# Altium schematic sheet AQCA-Control-IO-B0.SchDoc
size A4
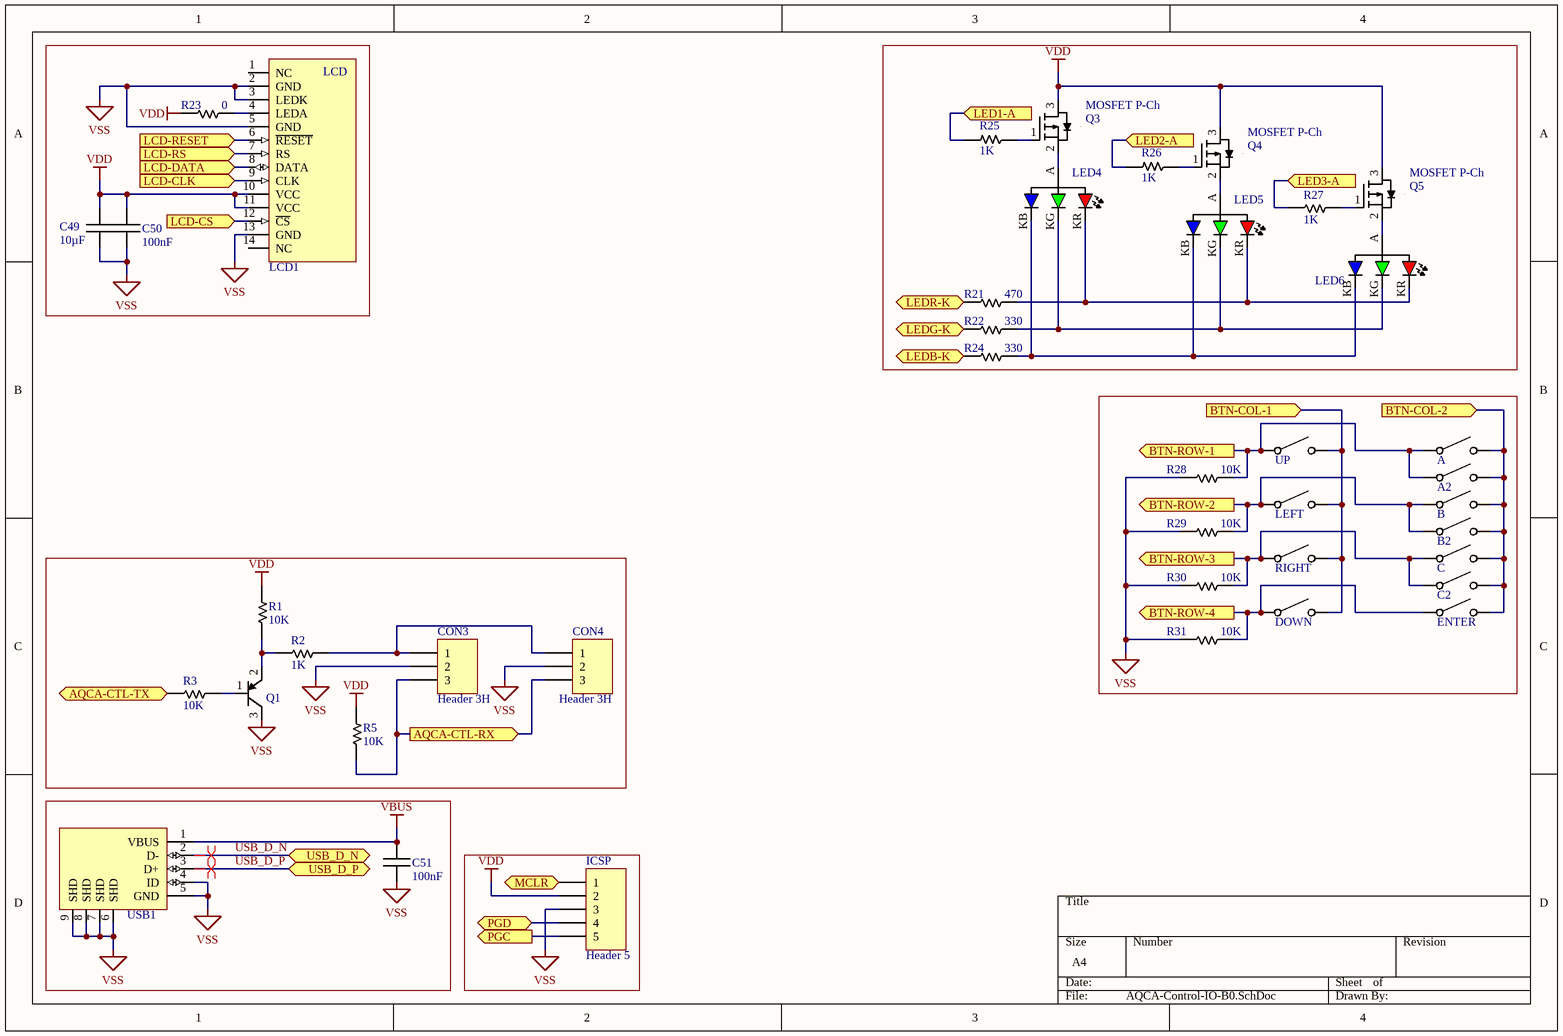
[diagram p0: AQCA-Control-IO-B0.SchDoc]

## Parts
A  Tact Button NO  [TACT SMD 4.5×4.5mm]  (value not drawn)
A2  Tact Button NO  [TACT SMD 4.5×4.5mm]  (value not drawn)
B  Tact Button NO  [TACT SMD 4.5×4.5mm]  (value not drawn)
B2  Tact Button NO  [TACT SMD 4.5×4.5mm]  (value not drawn)
C  Tact Button NO  [TACT SMD 4.5×4.5mm]  (value not drawn)
C2  Tact Button NO  [TACT SMD 4.5×4.5mm]  (value not drawn)
C49  10µF  [CAPC3225N]
C50  100nF  [CAPC1608N]
C51  100nF  [CAPC1608N]
CON3  Header 3H  [HDR1X3H]
CON4  Header 3H  [HDR1X3H]
DOWN  Tact Button NO  [TACT SMD 4.5×4.5mm]  (value not drawn)
ENTER  Tact Button NO  [TACT SMD 4.5×4.5mm]  (value not drawn)
ICSP  Header 5  [HDR1X5]
LCD1  LCD JD-T1800  [LCD JD-T1800]  (value not drawn)
LED4  LED RGB common A  [LED 3528m]  (value not drawn)
LED5  LED RGB common A  [LED 3528m]  (value not drawn)
LED6  LED RGB common A  [LED 3528m]  (value not drawn)
LEFT  Tact Button NO  [TACT SMD 4.5×4.5mm]  (value not drawn)
Q1  *  [SOT23_N]  (value not drawn)
Q3  MOSFET P-Ch  [SOT23-3N]
Q4  MOSFET P-Ch  [SOT23-3N]
Q5  MOSFET P-Ch  [SOT23-3N]
R1  10K  [RESC1608N]
R2  1K  [RESC1608N]
R3  10K  [RESC1608N]
R5  10K  [RESC1608N]
R21  470  [RESC1608N]
R22  330  [RESC1608N]
R23  0  [RESC1608N]
R24  330  [RESC1608N]
R25  1K  [RESC1608N]
R26  1K  [RESC1608N]
R27  1K  [RESC1608N]
R28  10K  [RESC1608N]
R29  10K  [RESC1608N]
R30  10K  [RESC1608N]
R31  10K  [RESC1608N]
RIGHT  Tact Button NO  [TACT SMD 4.5×4.5mm]  (value not drawn)
UP  Tact Button NO  [TACT SMD 4.5×4.5mm]  (value not drawn)
USB1  USB-Conn Mini-B SMD  [440478]  (value not drawn)

## Ports
AQCA-CTL-RX (out), AQCA-CTL-TX (in), BTN-COL-1 (in), BTN-COL-2 (in), BTN-ROW-1 (out), BTN-ROW-2 (out), BTN-ROW-3 (out), BTN-ROW-4 (out), LCD-CLK (in), LCD-CS (in), LCD-DATA (in), LCD-RESET (in), LCD-RS (in), LED1-A (in), LED2-A (in), LED3-A (in), LEDB-K (in), LEDG-K (in), LEDR-K (in), MCLR (out), PGC (out), PGD (bidir), USB_D_N (bidir), USB_D_P (bidir)

## Nets
VBUS: C51.2 USB1.1(VBUS)
VDD: C49.2 C50.2 ICSP.2 LCD1.10(VCC) LCD1.11(VCC) Q3.3(D) Q4.3(D) Q5.3(D) R1.2 R5.2 R23.1
VSS: C49.1 C50.1 C51.1 CON3.2 CON4.2 ICSP.3 LCD1.2(GND) LCD1.3(LEDK) LCD1.5(GND) LCD1.13(GND) Q1.3(C) R28.1 R29.1 R30.1 R31.1 USB1.4(ID) USB1.5(GND) USB1.6(SHD) USB1.7(SHD) USB1.8(SHD) USB1.9(SHD)
AQCA-CTL-RX: CON3.3 CON4.3 R5.1 ; port AQCA-CTL-RX
AQCA-CTL-TX: R3.1 ; port AQCA-CTL-TX
BTN-COL-1: DOWN.2 LEFT.2 RIGHT.2 UP.2 ; port BTN-COL-1
BTN-COL-2: A.2 A2.2 B.2 B2.2 C.2 C2.2 ENTER.2 ; port BTN-COL-2
BTN-ROW-1: A.1 A2.1 R28.2 UP.1 ; port BTN-ROW-1
BTN-ROW-2: B.1 B2.1 LEFT.1 R29.2 ; port BTN-ROW-2
BTN-ROW-3: C.1 C2.1 R30.2 RIGHT.1 ; port BTN-ROW-3
BTN-ROW-4: DOWN.1 ENTER.1 R31.2 ; port BTN-ROW-4
LCD-CLK: LCD1.9(CLK) ; port LCD-CLK
LCD-CS: LCD1.12(~{CS}) ; port LCD-CS
LCD-DATA: LCD1.8(DATA) ; port LCD-DATA
LCD-RESET: LCD1.6(~{RESET}) ; port LCD-RESET
LCD-RS: LCD1.7(RS) ; port LCD-RS
LED1-A: R25.2 ; port LED1-A
LED2-A: R26.2 ; port LED2-A
LED3-A: R27.1 ; port LED3-A
LEDB-K: R24.1 ; port LEDB-K
LEDG-K: R22.1 ; port LEDG-K
LEDR-K: R21.1 ; port LEDR-K
MCLR: ICSP.1 ; port MCLR
PGC: ICSP.5 ; port PGC
PGD: ICSP.4 ; port PGD
USB_D_N: USB1.2(D-) ; port USB_D_N
USB_D_P: USB1.3(D+) ; port USB_D_P
NetCON3_1: CON3.1 CON4.1 R2.2
NetLCD1_4: LCD1.4(LEDA) R23.2
NetLED4_A: LED4.A Q3.2(S)
NetLED4_KB: LED4.KB LED5.KB LED6.KB R24.2
NetLED4_KG: LED4.KG LED5.KG LED6.KG R22.2
NetLED4_KR: LED4.KR LED5.KR LED6.KR R21.2
NetLED5_A: LED5.A Q4.2(S)
NetLED6_A: LED6.A Q5.2(S)
NetQ1_1: Q1.1(B) R3.2
NetQ1_2: Q1.2(E) R1.1 R2.1
NetQ3_1: Q3.1(G) R25.1
NetQ4_1: Q4.1(G) R26.1
NetQ5_1: Q5.1(G) R27.2

Not connected (* = marked no-connect by the designer): LCD1 1(NC) 14(NC)

## Layout directives
differential pair: USB_D_N, USB_D_P

## Notes on the sheet
- (in symbol LCD JD-T1800) LCD

## Library data of the parts
A A2 B B2 C C2 DOWN ENTER LEFT RIGHT UP = Tact Button NO: pin to pad: 2>4
C49 = Capacitor: Voltage: 25V; Value: 10µF
C50 C51 = Capacitor: Voltage: 16V; Value: 100nF
CON3 CON4 = Header 3H: Header, 3-Pin, Right Angle; LatestRevisionDate: 17-Jul-2002; LatestRevisionNote: Re-released for DXP Platform.; Publisher: Altium Limited
ICSP = Header 5: Header, 5-Pin; LatestRevisionDate: 17-Jul-2002; LatestRevisionNote: Re-released for DXP Platform.; Publisher: Altium Limited
LCD1 = LCD JD-T1800: Resolution: 128*160; Screen Size: 1.8"
LED4-LED6 = LED RGB common A: pin to pad: A>2 KB>3 KG>4 KR>1
Q1 = PNP: pin to pad: 1>3 3>1; Model: *
R1-R3 R5 R21-R31 = Resistor
  R1 R3 R5 R28-R31: Value: 10K
  R2 R25-R27: Value: 1K
  R21: Value: 470
  R22 R24: Value: 330
  R23: Value: 0
Q3-Q5 = MOSFET P-Ch: Model: *